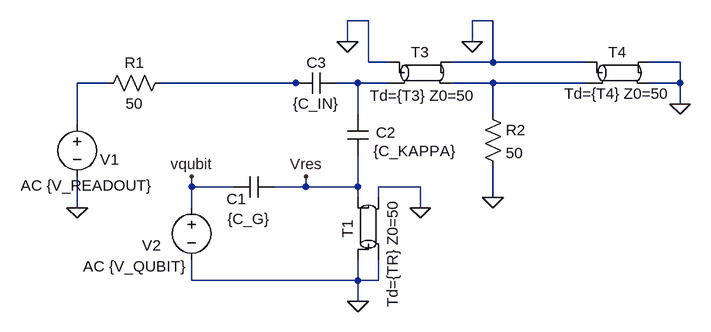
[diagram p0: schematic screenshot.asc]
screenshot.asc, the LTspice schematic file:
Version 4
SHEET 1 1544 784
WIRE 192 64 160 64
WIRE 384 64 352 64
WIRE 160 96 160 64
WIRE 352 96 352 64
WIRE 192 128 192 64
WIRE 224 128 192 128
WIRE 384 128 384 64
WIRE 384 128 320 128
WIRE 528 128 384 128
WIRE 672 128 624 128
WIRE -208 160 -256 160
WIRE 80 160 -128 160
WIRE 96 160 80 160
WIRE 176 160 144 160
WIRE 224 160 176 160
WIRE 384 160 320 160
WIRE 528 160 384 160
WIRE 672 160 672 128
WIRE 672 160 624 160
WIRE 672 192 672 160
WIRE 176 208 176 160
WIRE 384 208 384 160
WIRE -256 224 -256 160
WIRE -80 320 -80 304
WIRE -16 320 -80 320
WIRE 96 320 96 304
WIRE 96 320 48 320
WIRE 176 320 176 272
WIRE 176 320 96 320
WIRE 272 320 208 320
WIRE 176 336 176 320
WIRE 208 336 208 320
WIRE 384 336 384 288
WIRE -256 352 -256 304
WIRE -80 352 -80 320
WIRE 272 352 272 320
WIRE -80 464 -80 432
WIRE 176 464 176 432
WIRE 176 464 -80 464
WIRE 208 464 208 432
WIRE 208 464 176 464
WIRE 176 496 176 464
FLAG 672 192 0
FLAG 384 336 0
FLAG 160 96 0
FLAG 352 96 0
FLAG 96 304 Vres
FLAG -256 352 0
FLAG 176 496 0
FLAG 272 352 0
FLAG -80 304 vqubit
SYMBOL tline 272 144 R0
WINDOW 3 5 20 Top 2
SYMATTR InstName T3
SYMATTR Value Td={T3} Z0=50
SYMBOL tline 576 144 R0
SYMATTR InstName T4
SYMATTR Value Td={T4} Z0=50
SYMBOL res 368 192 R0
SYMATTR InstName R2
SYMATTR Value 50
SYMBOL cap 160 208 R0
WINDOW 0 44 28 Left 2
WINDOW 3 40 57 Left 2
SYMATTR InstName C2
SYMATTR Value {C_KAPPA}
SYMBOL cap 144 144 R90
WINDOW 0 0 32 VBottom 2
WINDOW 3 32 32 VTop 2
SYMATTR InstName C3
SYMATTR Value {C_IN}
SYMBOL voltage -256 208 R0
WINDOW 3 24 44 Left 2
WINDOW 123 -87 110 Left 2
WINDOW 39 24 152 Left 2
WINDOW 0 35 70 Left 2
SYMATTR Value ""
SYMATTR Value2 AC {V_READOUT}
SYMATTR InstName V1
SYMBOL res -112 144 R90
WINDOW 0 0 56 VBottom 2
WINDOW 3 32 56 VTop 2
SYMATTR InstName R1
SYMATTR Value 50
SYMBOL tline 192 384 R270
WINDOW 3 -38 22 Top 2
SYMATTR InstName T1
SYMATTR Value Td={TR} Z0=50
SYMBOL voltage -80 336 R0
WINDOW 3 24 44 Left 2
WINDOW 123 -167 106 Left 2
WINDOW 39 24 152 Left 2
WINDOW 0 -76 74 Left 2
SYMATTR Value ""
SYMATTR Value2 AC {V_QUBIT}
SYMATTR InstName V2
SYMBOL cap 48 304 R90
WINDOW 0 50 59 VBottom 2
WINDOW 3 50 40 VTop 2
SYMATTR InstName C1
SYMATTR Value {C_G}

The netlist it stands for:
* screenshot.asc
T3 0 N003 0 N004 Td={T3} Z0=50
T4 0 N004 0 0 Td={T4} Z0=50
R2 N004 0 50
C2 N003 Vres {C_KAPPA}
C3 N003 N002 {C_IN}
V1 N001 0 AC {V_READOUT}
R1 N002 N001 50
T1 0 0 Vres 0 Td={TR} Z0=50
V2 vqubit 0 AC {V_QUBIT}
C1 Vres vqubit {C_G}
.backanno
.end